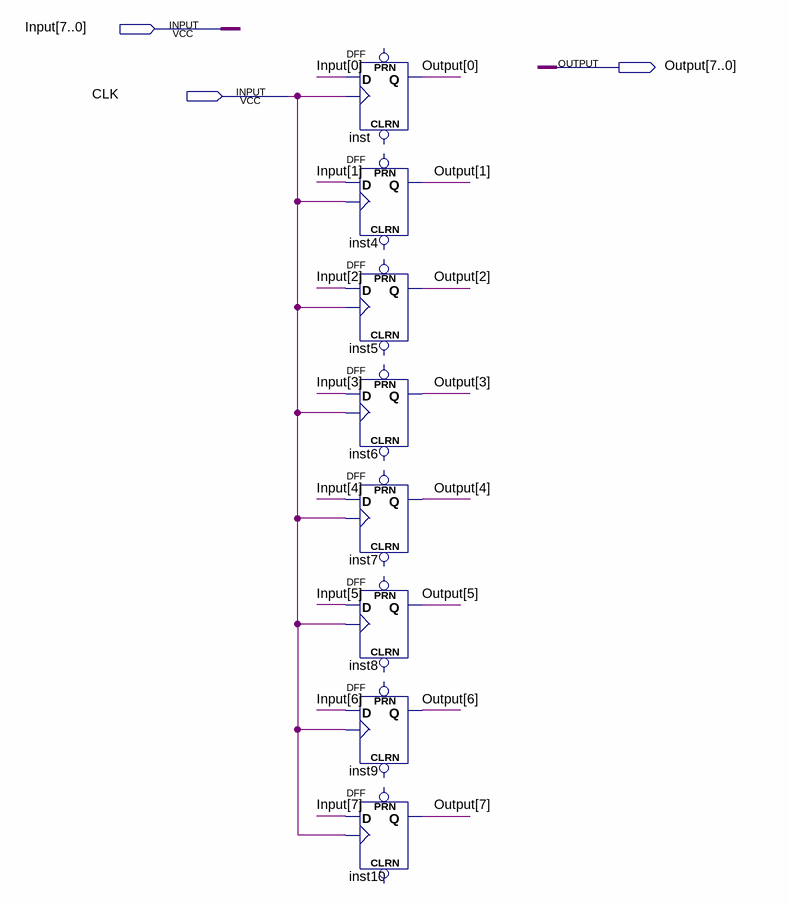
[diagram p0: schematic sheet]
// Quartus schematic Reg.bdf as structural Verilog: 8 symbols, 3 pins
module Reg (
  input  [7:0] Input,
  input  CLK,
  output [7:0] Output
);

  DFF inst (.CLK(CLK), .D(Input[0]), .Q(Output[0]));  // open: CLRN, PRN
  DFF inst4 (.CLK(CLK), .D(Input[1]), .Q(Output[1]));  // open: CLRN, PRN
  DFF inst5 (.CLK(CLK), .D(Input[2]), .Q(Output[2]));  // open: CLRN, PRN
  DFF inst6 (.CLK(CLK), .D(Input[3]), .Q(Output[3]));  // open: CLRN, PRN
  DFF inst7 (.CLK(CLK), .D(Input[4]), .Q(Output[4]));  // open: CLRN, PRN
  DFF inst8 (.CLK(CLK), .D(Input[5]), .Q(Output[5]));  // open: CLRN, PRN
  DFF inst9 (.CLK(CLK), .D(Input[6]), .Q(Output[6]));  // open: CLRN, PRN
  DFF inst10 (.CLK(CLK), .D(Input[7]), .Q(Output[7]));  // open: CLRN, PRN
endmodule
